# Altium schematic sheet DDS.SchDoc
size A3; SheetNumber: 1; SheetTotal: 1
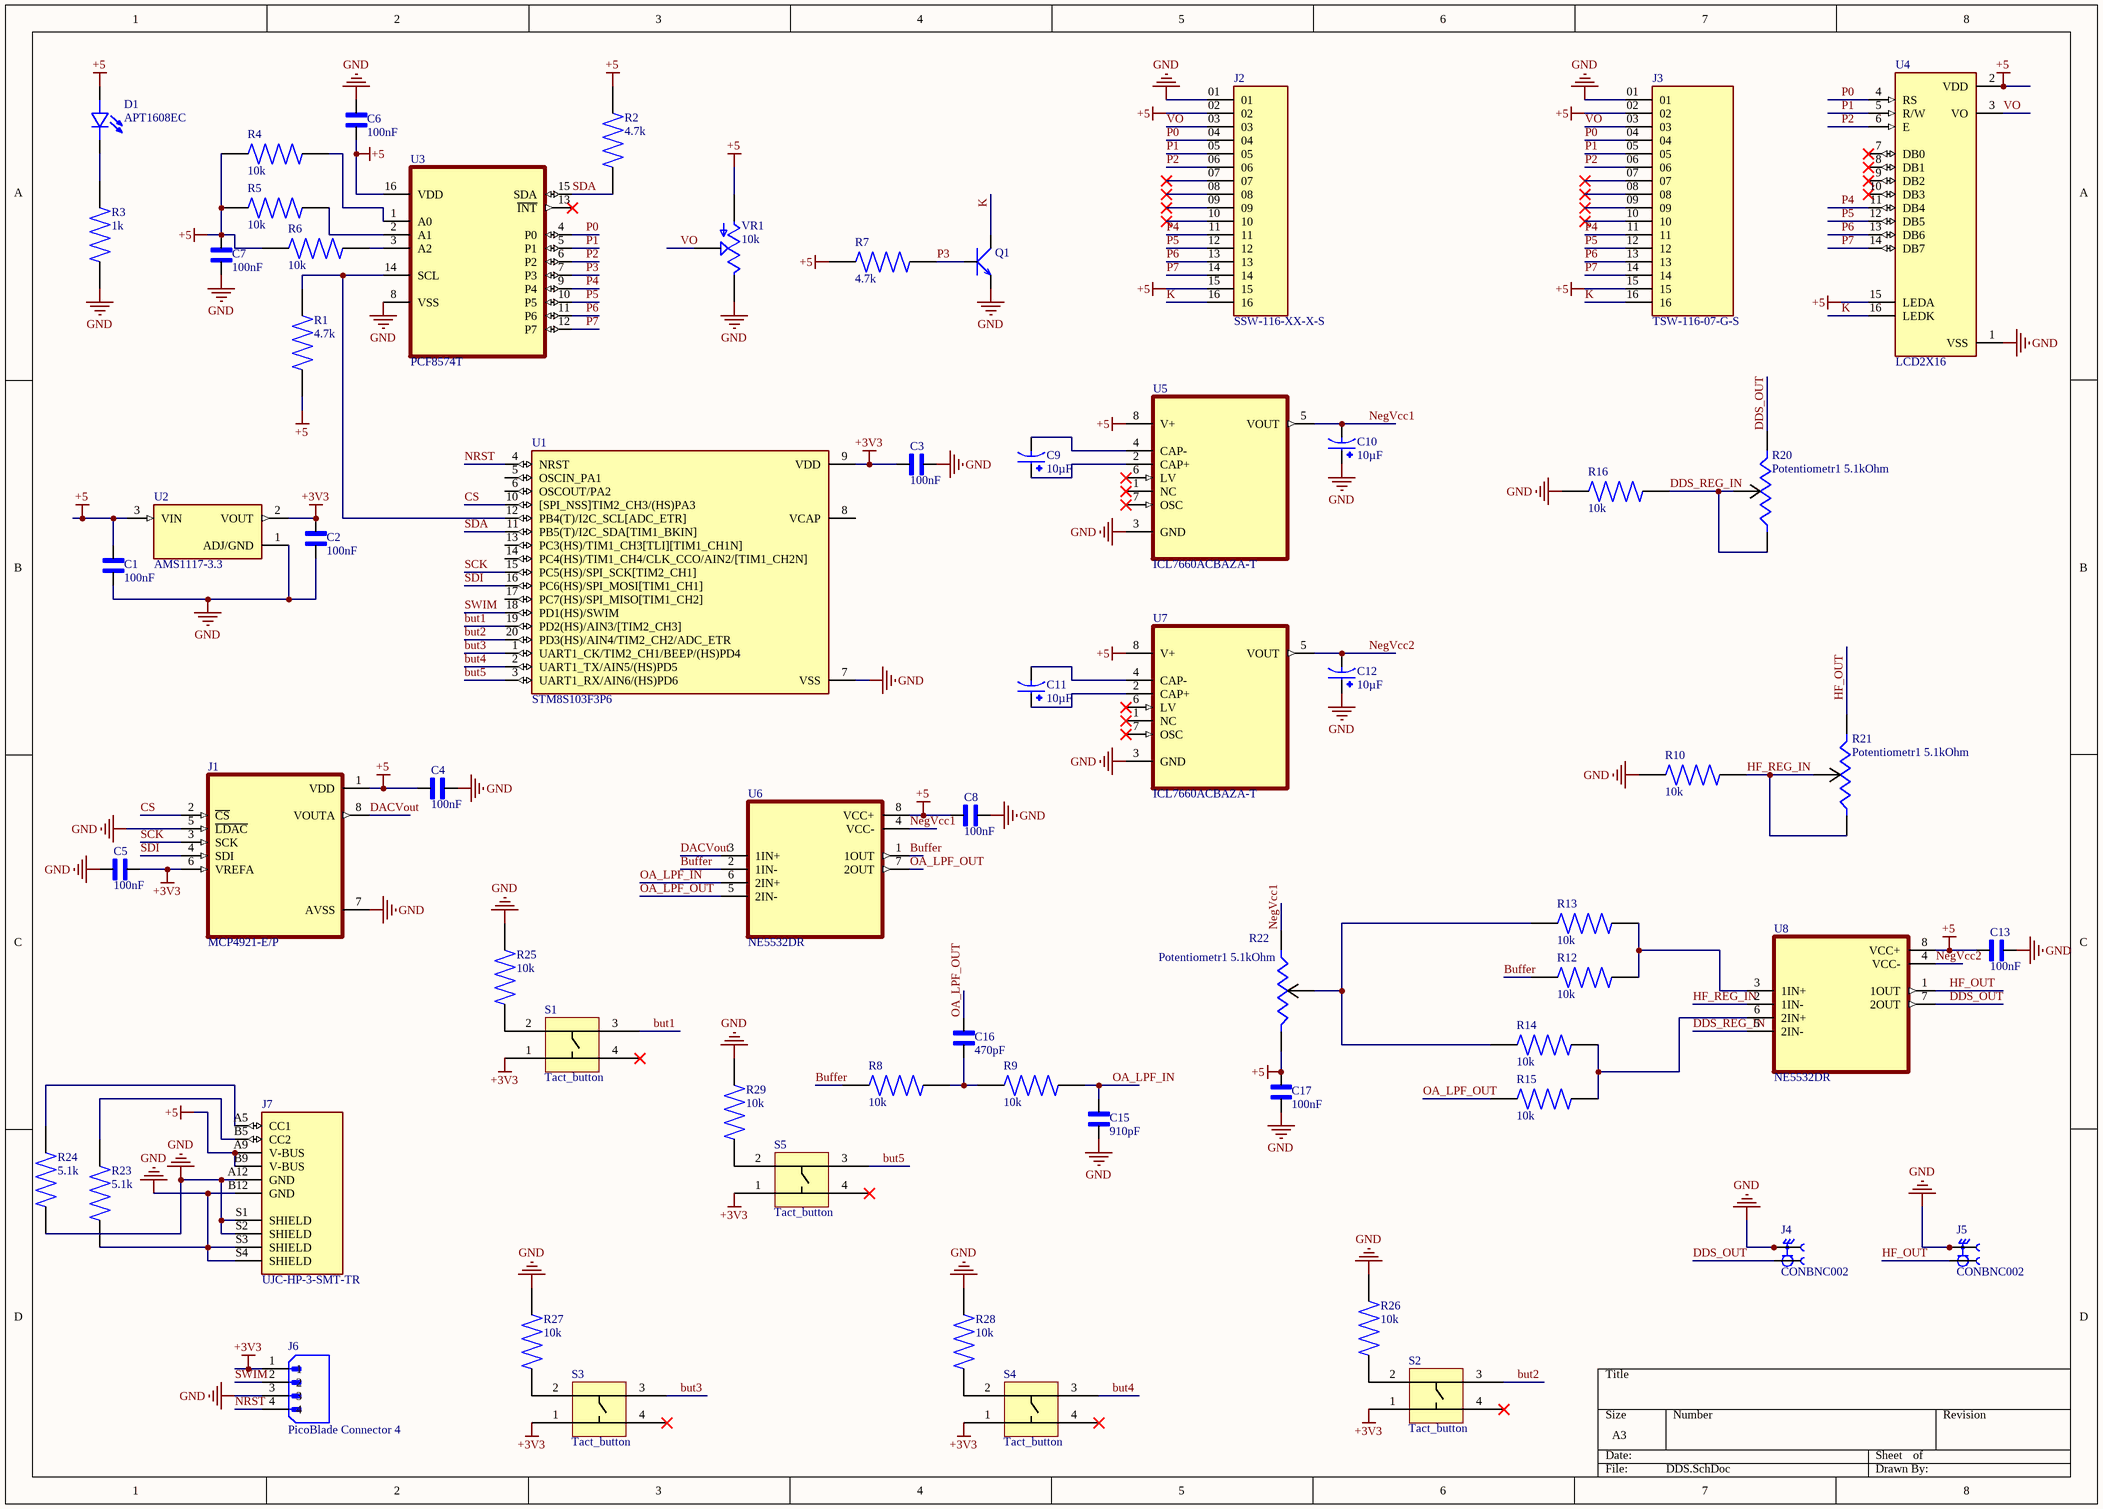
[diagram p0: DDS.SchDoc]

## Parts
C1  value 100nF  [CAPC1608X90N]  (hidden comment: CL10B104KB8NNNC)
C2  value 100nF  [CAPC1608X90N]  (hidden comment: CL10B104KB8NNNC)
C3  value 100nF  [CAPC1608X90N]  (hidden comment: CL10B104KB8NNNC)
C4  value 100nF  [CAPC1608X90N]  (hidden comment: CL10B104KB8NNNC)
C5  value 100nF  [CAPC1608X90N]  (hidden comment: CL10B104KB8NNNC)
C6  value 100nF  [CAPC1608X90N]  (hidden comment: CL10B104KB8NNNC)
C7  value 100nF  [CAPC1608X90N]  (hidden comment: CL10B104KB8NNNC)
C8  value 100nF  [CAPC1608X90N]  (hidden comment: CL10B104KB8NNNC)
C9  value 10µF  [CAPPRD150W45D400H700]  (hidden comment: EEAFC1E100)
C10  value 10µF  [CAPPRD150W45D400H700]  (hidden comment: EEAFC1E100)
C11  value 10µF  [CAPPRD150W45D400H700]  (hidden comment: EEAFC1E100)
C12  value 10µF  [CAPPRD150W45D400H700]  (hidden comment: EEAFC1E100)
C13  value 100nF  [CAPC1608X90N]  (hidden comment: CL10B104KB8NNNC)
C15  value 910pF  [CAPC0603X33N]  (hidden comment: GRM0335C1E911JA01D)
C16  value 470pF  [CAPC1608X90N]  (hidden comment: CL10C471JB8NNNC)
C17  value 100nF  [CAPC1608X90N]  (hidden comment: CL10B104KB8NNNC)
D1  APT1608EC  [LED_APT1608EC]
J1  MCP4921-E/P  [DIP787W46P254L927H533Q8]
J2  SSW-116-XX-X-S  [SAMTEC_SSW-116-XX-X-S]
J3  TSW-116-07-G-S  [SAMTEC_TSW-116-07-G-S]
J4  CONBNC002  [LINX_CONBNC002]
J5  CONBNC002  [LINX_CONBNC002]
J6  PicoBlade Connector 4  [MOLEX_530470410]
J7  UJC-HP-3-SMT-TR  [CUI_UJC-HP-3-SMT-TR]
Q1  SMD-TRANSISTORS-NPN-25V-500MW(SOT-23)  [SOT-23]  (value not drawn)
R1  value 4.7k  [RESC1608X55N]  (hidden comment: ERJ-P03F4701V)
R2  value 4.7k  [RESC1608X55N]  (hidden comment: ERJ-P03F4701V)
R3  value 1k  [RES_ERJP03F1001V]  (hidden comment: ERJP03F1001V)
R4  value 10k  [RES_ERJPA3F1002V]  (hidden comment: ERJPA3F1002V)
R5  value 10k  [RES_ERJPA3F1002V]  (hidden comment: ERJPA3F1002V)
R6  value 10k  [RES_ERJPA3F1002V]  (hidden comment: ERJPA3F1002V)
R7  value 4.7k  [RESC1608X55N]  (hidden comment: ERJ-P03F4701V)
R8  value 10k  [RES_ERJPA3F1002V]  (hidden comment: ERJPA3F1002V)
R9  value 10k  [RES_ERJPA3F1002V]  (hidden comment: ERJPA3F1002V)
R10  value 10k  [RES_ERJPA3F1002V]  (hidden comment: ERJPA3F1002V)
R12  value 10k  [RES_ERJPA3F1002V]  (hidden comment: ERJPA3F1002V)
R13  value 10k  [RES_ERJPA3F1002V]  (hidden comment: ERJPA3F1002V)
R14  value 10k  [RES_ERJPA3F1002V]  (hidden comment: ERJPA3F1002V)
R15  value 10k  [RES_ERJPA3F1002V]  (hidden comment: ERJPA3F1002V)
R16  value 10k  [RES_ERJPA3F1002V]  (hidden comment: ERJPA3F1002V)
R20  Potentiometr1 5.1kOhm  [PotentiomenerFootprint]
R21  Potentiometr1 5.1kOhm  [PotentiomenerFootprint]
R22  Potentiometr1 5.1kOhm  [PotentiomenerFootprint]
R23  value 5.1k  [RES_ERJPA3F5101V]  (hidden comment: ERJPA3F5101V)
R24  value 5.1k  [RES_ERJPA3F5101V]  (hidden comment: ERJPA3F5101V)
R25  value 10k  [RES_ERJPA3F1002V]  (hidden comment: ERJPA3F1002V)
R26  value 10k  [RES_ERJPA3F1002V]  (hidden comment: ERJPA3F1002V)
R27  value 10k  [RES_ERJPA3F1002V]  (hidden comment: ERJPA3F1002V)
R28  value 10k  [RES_ERJPA3F1002V]  (hidden comment: ERJPA3F1002V)
R29  value 10k  [RES_ERJPA3F1002V]  (hidden comment: ERJPA3F1002V)
S1  Tact_button  [TactButtonFootprint]
S2  Tact_button  [TactButtonFootprint]
S3  Tact_button  [TactButtonFootprint]
S4  Tact_button  [TactButtonFootprint]
S5  Tact_button  [TactButtonFootprint]
U1  STM8S103F3P6  [SOP65P640X120-20N]
U2  AMS1117-3.3  [SOT229P700X180-4N]
U3  PCF8574T  [SOIC127P1032X265-16N]
U4  LCD2X16  [LCD_LCD2X16]
U5  ICL7660ACBAZA-T  [SOIC127P600X175-8N]
U6  NE5532DR  [SOIC127P599X175-8N]
U7  ICL7660ACBAZA-T  [SOIC127P600X175-8N]
U8  NE5532DR  [SOIC127P599X175-8N]
VR1  value 10k  [TRIM_3362P-1-103LF]  (hidden comment: 3362P-1-103LF)

## Nets
+3V3: C2.2 C3.2 C5.2 J1.6(VREFA) J6.1 S1.1 S2.1 S3.1 S4.1 S5.1 U1.9(VDD) U2.2(VOUT)
+5: C1.2 C4.2 C6.2 C7.2 C8.2 C13.2 C17.2 D1.2(A) J1.1(VDD) J2.02 J2.15 J3.02 J3.15 J7.A9(V-BUS) J7.B9(V-BUS) R1.2 R2.2 R4.2 R5.2 R6.2 R7.1 R22.1 U2.3(VIN) U3.16(VDD) U4.2(VDD) U4.15(LEDA) U5.8(V+) U6.8(VCC+) U7.8(V+) U8.8(VCC+) VR1.1(CCW)
GND: C1.1 C2.1 C3.1 C4.1 C5.1 C6.1 C7.1 C8.1 C10.P C12.P C13.1 C15.1 C17.1 J1.5(~{LDAC}) J1.7(AVSS) J2.01 J3.01 J4.2 J4.S1 J4.S2 J5.2 J5.S1 J5.S2 J6.3 J7.A12(GND) J7.B12(GND) J7.S1(SHIELD) J7.S2(SHIELD) J7.S3(SHIELD) J7.S4(SHIELD) Q1.2(E) R3.1 R10.1 R16.1 R23.1 R24.1 R25.2 R26.2 R27.2 R28.2 R29.2 U1.7(VSS) U2.1(ADJ/GND) U3.8(VSS) U4.1(VSS) U5.3(GND) U7.3(GND) VR1.3(CW)
\: R1.1 U1.12(PB4(T)/I2C_SCL[ADC_ETR]) U3.14(SCL)
Buffer: R8.1 R12.2 U6.1(1OUT) U6.2(1IN-)
but1: S1.3 U1.19(PD2(HS)/AIN3/[TIM2_CH3])
but2: S2.3 U1.20(PD3(HS)/AIN4/TIM2_CH2/ADC_ETR)
but3: S3.3 U1.1(UART1_CK/TIM2_CH1/BEEP/(HS)PD4)
but4: S4.3 U1.2(UART1_TX/AIN5/(HS)PD5)
but5: S5.3 U1.3(UART1_RX/AIN6/(HS)PD6)
CS: J1.2(~{CS}) U1.10([SPI_NSS]TIM2_CH3/(HS)PA3)
DACVout: J1.8(VOUTA) U6.3(1IN+)
DDS_OUT: J4.1 R20.1 U8.7(2OUT)
DDS_REG_IN: R16.2 R20.2 R20.3 U8.5(2IN-)
HF_OUT: J5.1 R21.1 U8.1(1OUT)
HF_REG_IN: R10.2 R21.2 R21.3 U8.2(1IN-)
K: J2.16 J3.16 Q1.3(C) U4.16(LEDK)
NegVcc1: C10.N R22.3 U5.5(VOUT) U6.4(VCC-)
NegVcc2: C12.N U7.5(VOUT) U8.4(VCC-)
NRST: J6.4 U1.4(NRST)
OA_LPF_IN: C15.2 R9.1 U6.6(2IN+)
OA_LPF_OUT: C16.2 R15.2 U6.5(2IN-) U6.7(2OUT)
P0: J2.04 J3.04 U3.4(P0) U4.4(RS)
P1: J2.05 J3.05 U3.5(P1) U4.5(R/W)
P2: J2.06 J3.06 U3.6(P2) U4.6(E)
P3: Q1.1(B) R7.2 U3.7(P3)
P4: J2.11 J3.11 U3.9(P4) U4.11(DB4)
P5: J2.12 J3.12 U3.10(P5) U4.12(DB5)
P6: J2.13 J3.13 U3.11(P6) U4.13(DB6)
P7: J2.14 J3.14 U3.12(P7) U4.14(DB7)
SCK: J1.3(SCK) U1.15(PC5(HS)/SPI_SCK[TIM2_CH1])
SDA: R2.1 U1.11(PB5(T)/I2C_SDA[TIM1_BKIN]) U3.15(SDA)
SDI: J1.4(SDI) U1.16(PC6(HS)/SPI_MOSI[TIM1_CH1])
SWIM: J6.2 U1.18(PD1(HS)/SWIM)
VO: J2.03 J3.03 U4.3(VO) VR1.2(WIPER)
NetC9_N: C9.N U5.4(CAP-)
NetC9_P: C9.P U5.2(CAP+)
NetC11_N: C11.N U7.4(CAP-)
NetC11_P: C11.P U7.2(CAP+)
NetC16_1: C16.1 R8.2 R9.2
NetD1_1: D1.1(C) R3.2
NetJ7_A5: J7.A5(CC1) R24.2
NetJ7_B5: J7.B5(CC2) R23.2
NetR4_1: R4.1 U3.1(A0)
NetR5_1: R5.1 U3.2(A1)
NetR6_1: R6.1 U3.3(A2)
NetR12_1: R12.1 R13.1 U8.3(1IN+)
NetR13_2: R13.2 R14.2 R22.2
NetR14_1: R14.1 R15.1 U8.6(2IN+)
NetR25_1: R25.1 S1.2
NetR26_1: R26.1 S2.2
NetR27_1: R27.1 S3.2
NetR28_1: R28.1 S4.2
NetR29_1: R29.1 S5.2

Not connected (* = marked no-connect by the designer): J1 0(3); J2 07* 08* 09* 10*; J3 07* 08* 09* 10*; S1 4*; S2 4*; S3 4*; S4 4*; S5 4*; U1 5(OSCIN_PA1) 6(OSCOUT/PA2) 8(VCAP) 13(PC3(HS)/TIM1_CH3[TLI][TIM1_CH1N]) 14(PC4(HS)/TIM1_CH4/CLK_CCO/AIN2/[TIM1_CH2N]) 17(PC7(HS)/SPI_MISO[TIM1_CH2]); U3 13(~{INT})*; U4 7(DB0)* 8(DB1)* 9(DB2)* 10(DB3)*; U5 1(NC)* 6(LV)* 7(OSC)*; U7 1(NC)* 6(LV)* 7(OSC)*

## Library data of the parts
C1-C8 C13 C17 = CMP-001-00223-1: 0.1 ВµF В±10% 50V Ceramic Capacitor X7R 0603 (1608 Metric); MF: Samsung Electro-Mechanics; Source: CL10B104KB8NNNC.SchLib; Component Type: Standard; MP: CL10B104KB8NNNC; Check_prices: https://www.snapeda.com/parts/CL10B104KB8NNNC/Samsung/view-part/?ref=eda; Case/Package: SMD-2 Samsung; SnapEDA_Link: https://www.snapeda.com/parts/CL10B104KB8NNNC/Samsung/view-part/?ref=snap; Pins: 2; Design Item ID: CL10B104KB8NNNC
C9-C12 = CMP-001-00225-1: 10F 25V Aluminum Electrolytic Capacitors Radial, Can 1000 Hrs @ 105C; MF: Panasonic; MP: EEAFC1E100; SnapEDA_Link: https://www.snapeda.com/parts/EEAFC1E100/Panasonic/view-part/?ref=snap; Design Item ID: EEAFC1E100; Source: EEAFC1E100.SchLib; Check_prices: https://www.snapeda.com/parts/EEAFC1E100/Panasonic/view-part/?ref=eda; Price: None; Component Type: Standard; Case/Package: RADIAL-2 Panasonic; Pins: 2; Availability: In Stock
C15 = CMP-001-00227-1: MF: Murata; Price: None; Pins: 2; Design Item ID: GRM0335C1E911JA01D; Availability: Unavailable; Component Type: Standard; Case/Package: None; MP: GRM0335C1E911JA01D; Source: GRM0335C1E911JA01D.SchLib
C16 = CMP-001-00228-1: 470 pF В±5% 50V Ceramic Capacitor C0G, NP0 0603 (1608 Metric); MF: Samsung; Case/Package: SMD-2 Samsung; Design Item ID: CL10C471JB8NNNC; Pins: 2; MP: CL10C471JB8NNNC; Check_prices: https://www.snapeda.com/parts/CL10C471JB8NNNC/Samsung/view-part/?ref=eda; Component Type: Standard; SnapEDA_Link: https://www.snapeda.com/parts/CL10C471JB8NNNC/Samsung/view-part/?ref=snap; Source: CL10C471JB8NNNC.SchLib
D1 = CMP-004-00043-1: Red 617nm LED Indication - Discrete 2V 0603 (1608 Metric); MF: Kingbright; Check_prices: https://www.snapeda.com/parts/APT1608EC/Kingbright/view-part/?ref=eda; Case/Package: 0603 Kingbright; MP: APT1608EC; SnapEDA_Link: https://www.snapeda.com/parts/APT1608EC/Kingbright/view-part/?ref=snap; Source: APT1608EC.SchLib; Design Item ID: APT1608EC; Component Type: Standard; Value: *; Pins: 2
J1 = CMP-015-00008-1: Microchip 12 bit Serial DAC 8-Pin PDIP; Design Item ID: MCP4921-E/P; MP: MCP4921-E/P; Source: MCP4921-E_P.SchLib; SnapEDA_Link: https://www.snapeda.com/parts/MCP4921-E/P/Microchip/view-part/?ref=snap; Case/Package: DIP-8 Microchip; Component Type: Standard; Value: *; Check_prices: https://www.snapeda.com/parts/MCP4921-E/P/Microchip/view-part/?ref=eda; Pins: 8; MF: Microchip
J2 = CMP-002-00127-1: Conn Socket Strip SKT 16 POS 2.54mm Solder ST Top Entry Thru-Hole Bulk; MP: SSW-116-06-G-S; MF: Samtec; Check_prices: https://www.snapeda.com/parts/SSW-116-06-G-S/Samtec/view-part/?ref=eda; SnapEDA_Link: https://www.snapeda.com/parts/SSW-116-06-G-S/Samtec/view-part/?ref=snap; Pins: 16; Design Item ID: SSW-116-XX-X-S; Case/Package: None; Value: *; Component Type: Standard; Source: SSW-116-XX-X-S.SchLib
J3 = CMP-159-000000-1: MF: Samtec; Availability: Unavailable; Pin Count: 16; Source: TSW-116-07-G-S.SchLib; Price: None; Package: None; MP: TSW-116-07-G-S; Component Type: Standard; Design Item ID: TSW-116-07-G-S; Value: *
J4 J5 = CMP-002-00123-1: BNC Jack 50 Ohm PCB Through Hole; MF: Linx Technologies Inc.; SnapEDA_Link: https://www.snapeda.com/parts/CONBNC002/Linx/view-part/?ref=snap; Value: *; Pins: 4; Case/Package: None; MP: CONBNC002; Component Type: Standard; Source: CONBNC002.SchLib; Check_prices: https://www.snapeda.com/parts/CONBNC002/Linx/view-part/?ref=eda; Design Item ID: CONBNC002
J6 = CMP-002-00128-1: Connector Header Through Hole 4 position 0.049 (1.25mm); MF: Molex; Value: *; Case/Package: None; SnapEDA_Link: https://www.snapeda.com/parts/530470410/Molex/view-part/?ref=snap; Source: 530470410.SchLib; Pins: 4; MP: 530470410; Component Type: Standard; Design Item ID: 530470410; Check_prices: https://www.snapeda.com/parts/530470410/Molex/view-part/?ref=eda
J7 = CMP-039-000004-1: Pin Count: 10; Value: *; MP: UJC-HP-3-SMT-TR; Price: None; Source: UJC-HP-3-SMT-TR.SchLib; Component Type: Standard; Package: None; Availability: Unavailable; Design Item ID: UJC-HP-3-SMT-TR
Q1 = CMP-141-000000-2: Bipolar (BJT) Transistor NPN 25 V 500 mA 150MHz 300 mW Surface Mount SOT-23; MF: UMW; MP: S8050; Source: SMD-TRANSISTORS-NPN-25V-500MW(SOT-23).SchLib; Package: None; Component Type: Standard; Price: None; Availability: In Stock; Pin Count: 3; Purchase-URL: https://pricing.snapeda.com/search/part/S8050/?ref=eda; SnapEDA_Link: https://www.snapeda.com/parts/S8050/Umwelt+Sensor+Teknik/view-part/?ref=snap; Value: *; Check_prices: https://www.snapeda.com/parts/S8050/Umwelt+Sensor+Teknik/view-part/?ref=eda; Design Item ID: SMD-TRANSISTORS-NPN-25V-500MW(SOT-23)
R1 R2 R7 = CMP-009-00424-1: Res Thick Film 0603 4.7K Ohm 1% 0.2W(1/5W) В±200ppm/C Pad SMD Automotive T/R; MF: Panasonic; SnapEDA_Link: https://www.snapeda.com/parts/ERJ-P03F4701V/Panasonic/view-part/?ref=snap; Design Item ID: ERJ-P03F4701V; Check_prices: https://www.snapeda.com/parts/ERJ-P03F4701V/Panasonic/view-part/?ref=eda; Source: ERJ-P03F4701V.SchLib; Case/Package: 1608-2 Panasonic; Pins: 2; Component Type: Standard; MP: ERJ-P03F4701V
R3 = CMP-009-00425-1: Thick Film Smnt Resistor 0603 Case 1kOhm +/-1% 0.2W +/-200ppm/degC; MF: Panasonic; SnapEDA_Link: https://www.snapeda.com/parts/ERJP03F1001V/Panasonic/view-part/?ref=snap; MP: ERJP03F1001V; Source: ERJP03F1001V.SchLib; Check_prices: https://www.snapeda.com/parts/ERJP03F1001V/Panasonic/view-part/?ref=eda; Design Item ID: ERJP03F1001V; Pins: 2; Component Type: Standard; Case/Package: 1608-2 Panasonic
R4-R6 R8-R10 R12-R16 R25-R29 = CMP-009-00428-1: 10 kOhms В±1% 0.25W, 1/4W Chip Resistor 0603 (1608 Metric) Automotive AEC-Q200, Pulse Withstanding Thick Film; MP: ERJ-PA3F1002V; MF: Panasonic; Pins: 2; SnapEDA_Link: https://www.snapeda.com/parts/ERJ-PA3F1002V/Panasonic/view-part/?ref=snap; Source: ERJPA3F1002V.SchLib; Component Type: Standard; Case/Package: 1608-2 Panasonic; Check_prices: https://www.snapeda.com/parts/ERJ-PA3F1002V/Panasonic/view-part/?ref=eda; Design Item ID: ERJPA3F1002V
R20-R22 = Potentiometr1
R23 R24 = CMP-009-00429-1: Thick Film Smnt Resistor 0603 Case 5.1kOhm +/-1% 0.25W +/-100ppm/degC; MF: Panasonic; Source: ERJPA3F5101V.SchLib; Case/Package: 1608-2 Panasonic; Check_prices: https://www.snapeda.com/parts/ERJPA3F5101V/Panasonic/view-part/?ref=eda; SnapEDA_Link: https://www.snapeda.com/parts/ERJPA3F5101V/Panasonic/view-part/?ref=snap; MP: ERJPA3F5101V; Design Item ID: ERJPA3F5101V; Component Type: Standard; Pins: 2
U1 = CMP-031-00018-1: STM8 series Microcontroller IC 8-Bit 16MHz 8KB (8K x 8) FLASH 20-TSSOP; MF: STMicroelectronics; Source: STM8S103F3P6.SchLib; SnapEDA_Link: https://www.snapeda.com/parts/STM8S103F3P6/STMicroelectronics/view-part/?ref=snap; MP: STM8S103F3P6; Check_prices: https://www.snapeda.com/parts/STM8S103F3P6/STMicroelectronics/view-part/?ref=eda; Pins: 20; Design Item ID: STM8S103F3P6; Component Type: Standard; Case/Package: TSSOP-20 STMicroelectronics; Value: *
U2 = CMP-031-00023-1: Linear Voltage Regulator IC Positive Fixed 1 Output 1A SOT-223-3L; MF: UMW; Design Item ID: AMS1117-3.3; SnapEDA_Link: https://www.snapeda.com/parts/AMS1117-3.3/UMW/view-part/?ref=snap; Pins: 3; Value: *; Case/Package: SOT-223-3L UMW; Check_prices: https://www.snapeda.com/parts/AMS1117-3.3/UMW/view-part/?ref=eda; MP: AMS1117-3.3; Source: AMS1117-3.3.SchLib; Component Type: Standard
U3 = CMP-098-000001-1: I/O Expander 8 IВІC 100 kHz 20-SSOP; MF: NXP Semiconductors; Purchase-URL: https://pricing.snapeda.com/search/part/PCF8574T/?ref=eda; Value: *; MP: PCF8574T; Price: None; Source: PCF8574T.SchLib; Check_prices: https://www.snapeda.com/parts/PCF8574T/NXP+Semiconductors/view-part/?ref=eda; Availability: In Stock; Pin Count: 16; Component Type: Standard; SnapEDA_Link: https://www.snapeda.com/parts/PCF8574T/NXP+Semiconductors/view-part/?ref=snap; Design Item ID: PCF8574T; Package: SOIC-16 NXP Semiconductors
U4 = CMP-110-000000-1: Display; Display: LCD 2x16 characters (blue backlight); MF: mikroElektronika; Source: LCD2X16.SchLib; Component Type: Standard; Check_prices: https://www.snapeda.com/parts/LCD%202X16/mikroElektronika/view-part/?ref=eda; Design Item ID: LCD2X16; SnapEDA_Link: https://www.snapeda.com/parts/LCD%202X16/mikroElektronika/view-part/?ref=snap; Pin Count: 16; MP: LCD 2X16; Package: TQFP-64 mikroElektronika; Value: *
U5 U7 = CMP-031-00021-1: Charge Pump Switching Regulator IC Positive or Negative Fixed -Vin, 2Vin 1 Output 45mA 8-SOIC (0.154, 3.90mm Width); MF: Renesas Electronics America Inc; Case/Package: SOIC-8 Renesas Electronics America Inc; Check_prices: https://www.snapeda.com/parts/ICL7660ACBAZA-T/Renesas/view-part/?ref=eda; SnapEDA_Link: https://www.snapeda.com/parts/ICL7660ACBAZA-T/Renesas/view-part/?ref=snap; Design Item ID: ICL7660ACBAZA-T; MP: ICL7660ACBAZA-T; Pins: 8; Component Type: Standard; Source: ICL7660ACBAZA-T.SchLib; Value: *
U6 U8 = CMP-014-00003-1: Dual, 30-V, 10-MHz, low-noise operational amplifier for audio applications; MF: Texas Instruments; Component Type: Standard; MP: NE5532DR; Design Item ID: NE5532DR; Value: *; Source: NE5532DR.SchLib; SnapEDA_Link: https://www.snapeda.com/parts/NE5532DR/Texas+Instruments/view-part/?ref=snap; Case/Package: SOIC-8 Texas Instruments; Pins: 8; Check_prices: https://www.snapeda.com/parts/NE5532DR/Texas+Instruments/view-part/?ref=eda
VR1 = CMP-009-00423-1: Trimmer, Cermet, Rest 10 Kilohms, PCB, 1 Turns, Pwr-Rtg 0.5 W, Tol 10%; MF: Bourns; Design Item ID: 3362P-1-103LF; Source: 3362P-1-103LF.SchLib; Component Type: Standard; MP: 3362P-1-103LF; Case/Package: 3362P-1 Bourns Inc.; Check_prices: https://www.snapeda.com/parts/3362P-1-103LF/Bourns/view-part/?ref=eda; Pins: 3; SnapEDA_Link: https://www.snapeda.com/parts/3362P-1-103LF/Bourns/view-part/?ref=snap